# EAGLE design ARDEC-controller-v1 (EAGLE 9.1.2)
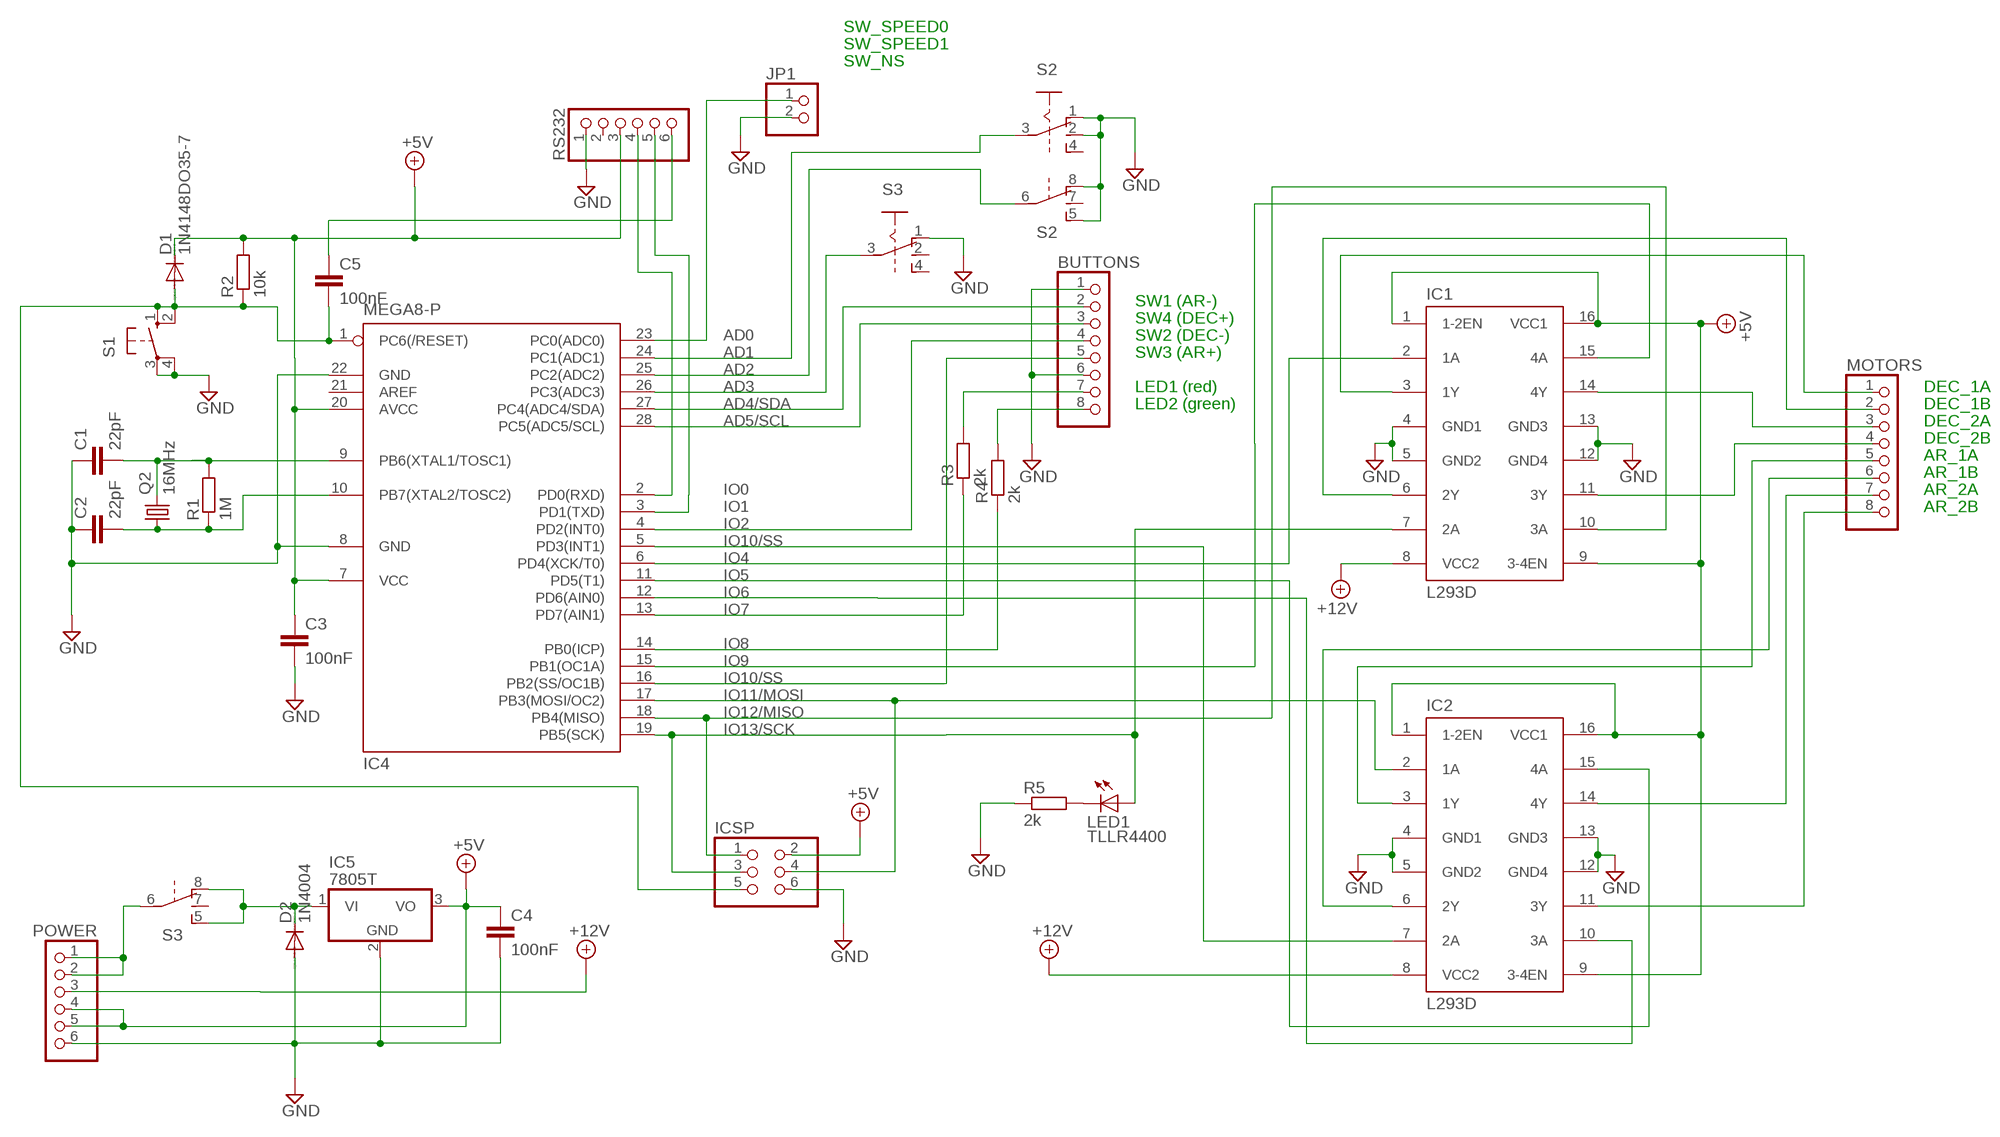
[diagram p0: schematic, sheet 1]

## Parts
BUTTONS  PINHD-1X8  [1X08]
C1  22pF  C2.5/2  [C2.5-2]
C2  22pF  C2.5/2  [C2.5-2]
C3  100nF  C-EU025_050-025X075  [C025_050-025X075]
C4  100nF  C-EU025_050-025X075  [C025_050-025X075]
C5  100nF  C-EU025_050-025X075  [C025_050-025X075]
D1  1N4148DO35-7  [DO35-7]
D2  1N4004  [DO41-10]
IC1  L293D  [DIL16]
IC2  L293D  [DIL16]
IC4  MEGA8-P  [DIL28-3]
IC5  7805T  [TO220H]
ICSP  PINHD-2X3  [2X03]
JP1  PINHD-1X2  [1X02]
LED1  TLLR4400  [LED3MM]
MOTORS  PINHD-1X8  [1X08]
POWER  PINHD-1X6  [1X06]
Q2  16MHz  CRYSTALHC18U-H  [HC18U-H]
R1  1M  R-EU_0207/10  [0207/10]
R2  10k  R-EU_0207/10  [0207/10]
R3  2k  R-EU_0207/10  [0207/10]
R4  2k  R-EU_0207/10  [0207/10]
R5  2k  R-EU_0207/10  [0207/10]
RS232  PINHD-1X6  [1X06]
S1  10-XX  [B3F-10XX]
S2  SL2C3P  [SL2C3P]
S3  SL2C3P  [SL2C3P]

## Nets
+5V [Power]: C3.1 C4.1 D1.C IC1.1(1-2EN) IC1.9(3-4EN) IC1.16(VCC1) IC2.1(1-2EN) IC2.9(3-4EN) IC2.16(VCC1) IC4.7(VCC) IC4.20(AVCC) IC5.3(VO) ICSP.2 POWER.4 POWER.5 R2.2 RS232.3
+12V [Power]: IC1.8(VCC2) IC2.8(VCC2) POWER.3
AD0: IC4.23(PC0(ADC0)) JP1.1
AD1: IC4.24(PC1(ADC1)) S2.3(A:Q)
AD2: IC4.25(PC2(ADC2)) S2.6(B:Q)
AD3: IC4.26(PC3(ADC3)) S3.3(A:Q)
AD4/SDA: BUTTONS.2 IC4.27(PC4(ADC4/SDA))
AD5/SCL: BUTTONS.3 IC4.28(PC5(ADC5/SCL))
GND [Power]: BUTTONS.1 BUTTONS.6 C1.1 C2.1 C3.2 C4.2 D2.A IC1.4(GND1) IC1.5(GND2) IC1.12(GND4) IC1.13(GND3) IC2.4(GND1) IC2.5(GND2) IC2.12(GND4) IC2.13(GND3) IC4.8(GND) IC4.22(GND) IC5.2(GND) ICSP.6 JP1.2 POWER.6 R5.1 RS232.1 S1.3(P) S1.4(P1) S2.1(A:O) S2.2(A:P) S2.5(B:R) S2.8(B:O) S3.1(A:O)
IO0: IC4.2(PD0(RXD)) RS232.4
IO1: IC4.3(PD1(TXD)) RS232.5
IO2: BUTTONS.4 IC4.4(PD2(INT0))
IO4: IC1.2(1A) IC4.6(PD4(XCK/T0))
IO5: IC2.15(4A) IC4.11(PD5(T1))
IO6: IC2.10(3A) IC4.12(PD6(AIN0))
IO7: IC4.13(PD7(AIN1)) R3.1
IO8: IC4.14(PB0(ICP)) R4.1
IO9: IC1.15(4A) IC4.15(PB1(OC1A))
IO10/SS: BUTTONS.5 IC4.16(PB2(SS/OC1B))
IO11/MOSI: IC2.2(1A) IC4.17(PB3(MOSI/OC2)) ICSP.4
IO12/MISO: IC1.10(3A) IC4.18(PB4(MISO)) ICSP.1
IO13/SCK: IC1.7(2A) IC4.19(PB5(SCK)) ICSP.3 LED1.A
N$1 [motors]: IC1.3(1Y) MOTORS.1
N$2 [motors]: IC1.6(2Y) MOTORS.2
N$3 [motors]: IC1.14(4Y) MOTORS.3
N$4 [motors]: IC1.11(3Y) MOTORS.4
N$5 [motors]: IC2.3(1Y) MOTORS.5
N$6 [motors]: IC2.6(2Y) MOTORS.6
N$7 [motors]: IC2.14(4Y) MOTORS.7
N$8 [motors]: IC2.11(3Y) MOTORS.8
N$9: BUTTONS.8 R4.2
N$10: BUTTONS.7 R3.2
N$11 [Power]: POWER.1 POWER.2 S3.6(B:Q)
N$12: LED1.K(C) R5.2
N$13: C1.2 IC4.9(PB6(XTAL1/TOSC1)) Q2.2 R1.2
N$14: C2.2 IC4.10(PB7(XTAL2/TOSC2)) Q2.1 R1.1
N$15: IC2.7(2A) IC4.5(PD3(INT1))
N$16: C5.1 RS232.6
N$17 [Power]: D2.C IC5.1(VI) S3.5(B:R) S3.8(B:O)
RESET: C5.2 D1.A IC4.1(PC6(/RESET)) ICSP.5 R2.1 S1.1(S) S1.2(S1)
Unconnected: IC4.21(AREF) RS232.2 S2.4(A:R) S2.7(B:P) S3.2(A:P) S3.4(A:R) S3.7(B:P)

## Notes on the sheet
- SW_SPEED0
- SW_SPEED1
- SW_NS
- SW1 (AR-)
- SW4 (DEC+)
- SW2 (DEC-)
- SW3 (AR+)
- LED1 (red) | DEC_1A
- LED2 (green) | DEC_1B
- DEC_2A
- DEC_2B
- AR_1A
- AR_1B
- AR_2A
- AR_2B

## Library data of the parts
BUTTONS MOTORS = pinhead:PINHD-1X8: PIN HEADER
C1 C2 = capacitor-wima:C: CAPACITOR naming: grid - package width
C3-C5 = resistor:C-EU: CAPACITOR, European symbol
D1 = diode:1N4148: DIODE high speed (Philips)
D2 = diode:1N4004: DIODE general purpose rectifier, 1 A
IC1 IC2 = st-microelectronics:L293D: PUSH-PULL 4 CHANNEL DRIVER; MPN: L293D; OC_FARNELL: 9589619; OC_NEWARK: 56P8249
IC4 = atmel:MEGA8-P: MICROCONTROLLER 8 Kbytes FLASH, 1 kbytes SRAM, 512 bytes EEPROM, USART, 4-channel 10 bit ADC, 2-channel 8 bit ADC Pin compatible with Atmega48, ATMega88, ATMega168 Source: avr.lbr; OC_FARNELL: unknown; OC_NEWARK: unknown
IC5 = linear:78*: Positive VOLTAGE REGULATOR Source: http://cache.national.com/ds/LM/LM78L05.pdf http://www.fairchildsemi.com/ds/LM/LM7805.pdf
ICSP = pinhead:PINHD-2X3: PIN HEADER
JP1 = pinhead:PINHD-1X2: PIN HEADER
LED1 = led:TLLR4400: Low Current (2mA) LED 3 mm Tinted Diffused Package color RED Source: Data sheet <http://www.farnell.com/datasheets/391100.pdf>; MF: VISHAY SEMICONDUCTOR; OC_FARNELL: 1612437
POWER RS232 = pinhead:PINHD-1X6: PIN HEADER
Q2 = crystal:CRYSTAL: CRYSTAL; OC_FARNELL: unknown; OC_NEWARK: unknown
R1-R5 = resistor:R-EU_: RESISTOR, European symbol
S1 = switch-omron:10-XX: OMRON SWITCH; MPN: B3F-1000; OC_FARNELL: 176432; OC_NEWARK: 36M3542
S2 S3 = sliding-switch:SL2C3P: SLIDING SWITCH 2C 3P

## Net classes
0 default: clearance 0.205 mm
1 Power: width 0.813 mm, clearance 0.205 mm to class 0, clearance 0.406 mm
2 motors: width 0.406 mm

## Board
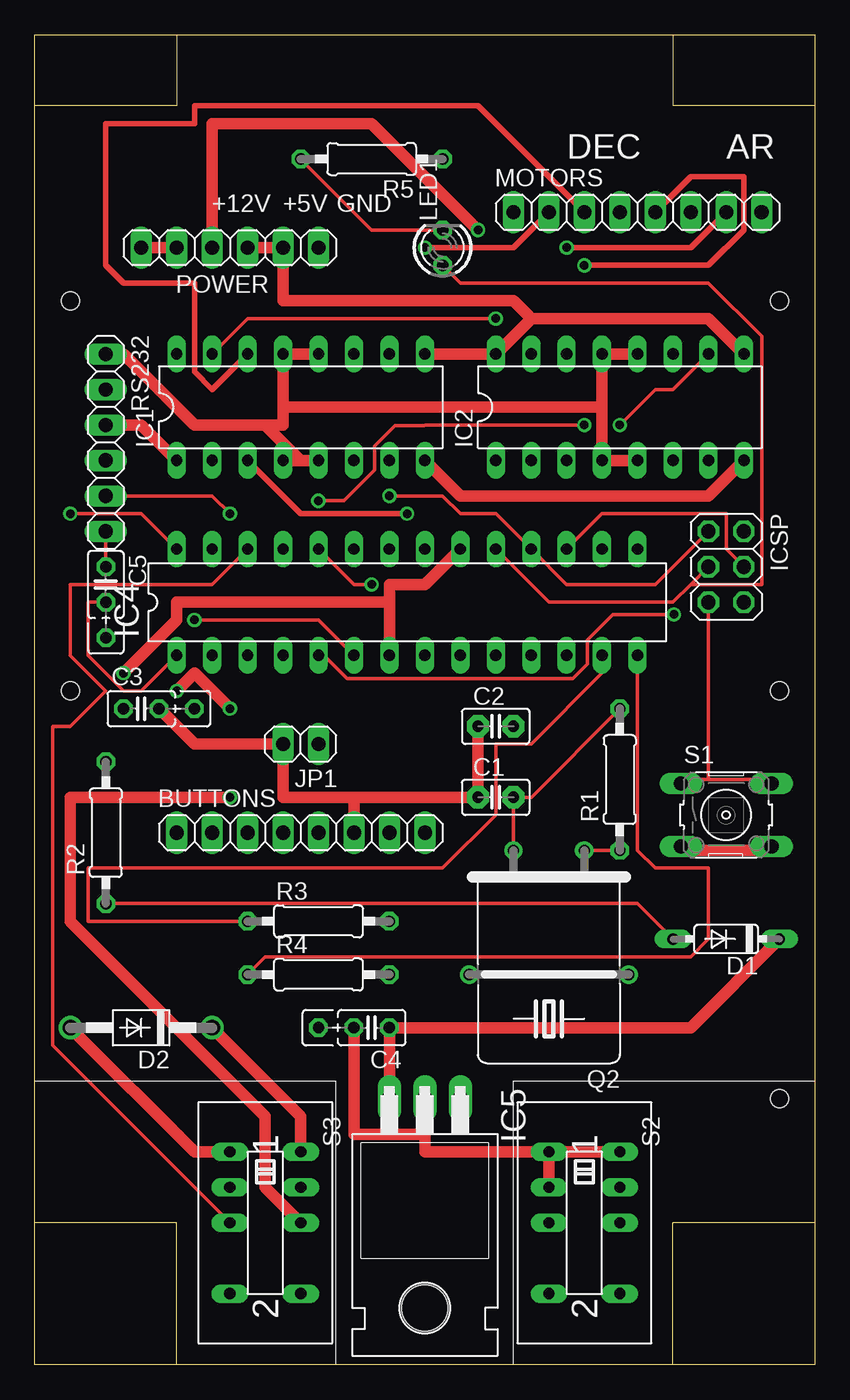
[diagram p1: board, top side]
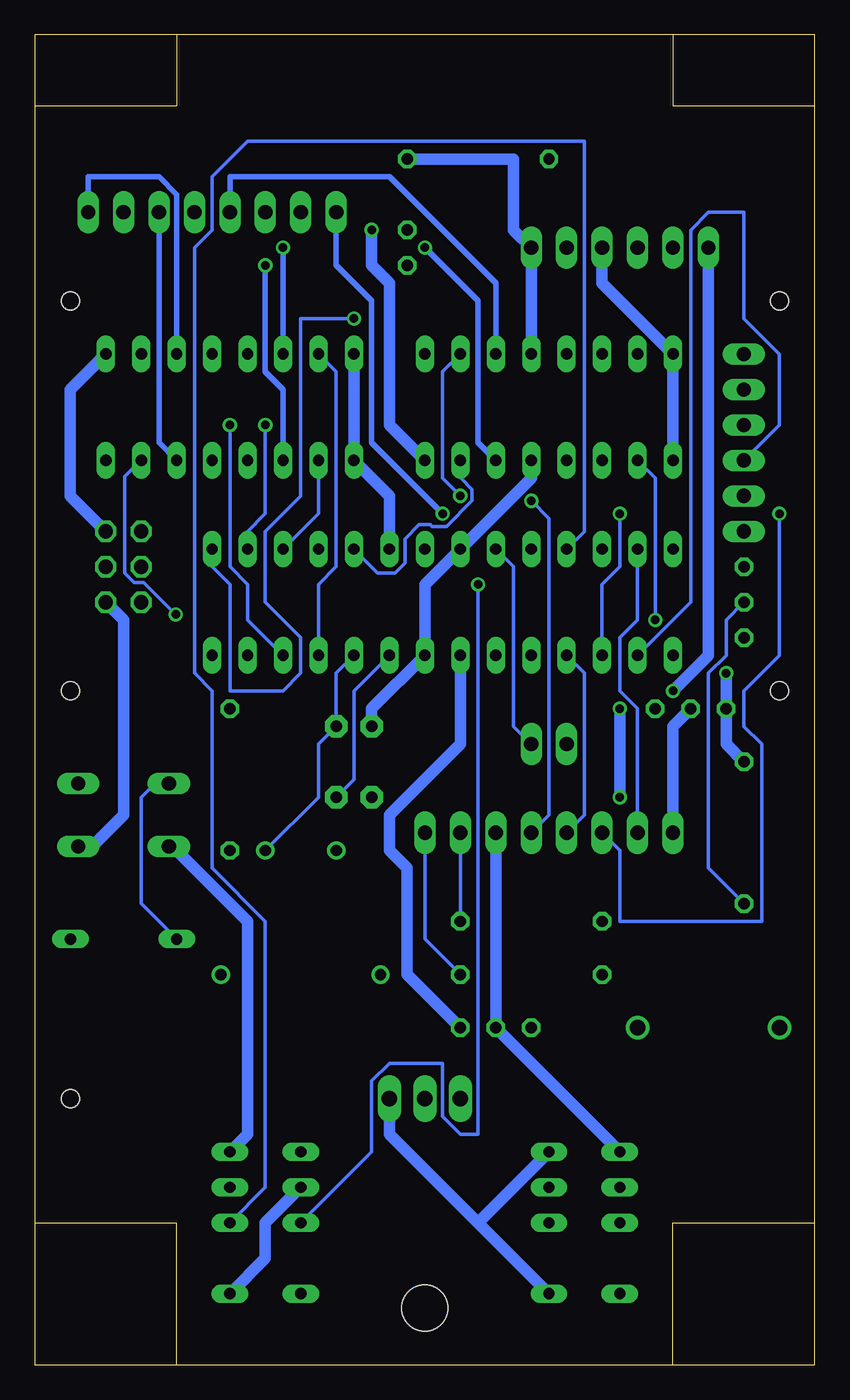
[diagram p2: board, bottom side, seen from below]

Size 55.88 x 95.25 mm. Coordinates in mm from the lower left corner, seen from the top.
Outline: 10.16,95.25 0,95.25 0,90.17
Outline: 10.16,95.25 45.72,95.25
Outline: 45.72,95.25 55.88,95.25 55.88,90.17
Outline: 45.72,0 55.88,0 55.88,7.62 55.88,10.16
Outline: 45.72,0 34.29,0 21.59,0 10.16,0
Outline: 10.16,0 0,0 0,7.62 0,10.16
Outline: 0,10.16 0,20.32 0,90.17
Outline: 55.88,90.17 55.88,20.32 55.88,10.16
Outline: 10.16,0 10.16,10.16 0,10.16
Outline: 55.88,10.16 45.72,10.16 45.72,0
Outline: 0,90.17 10.16,90.17 10.16,95.25
Outline: 55.88,90.17 45.72,90.17 45.72,95.25
Copper layers (1*16): Top 0.035mm / dielectric 1.5mm / Bottom 0.035mm
Design rules "default": minimum track width 10mil, minimum drill 24mil, track to track 8mil, track to pad 8mil, pad to pad 8mil, via to via 8mil, smd to smd 8mil, copper to edge 40mil, drill to drill 8mil, minimum pad ring 10mil, minimum via ring 8mil, stop-mask expansion 4mil, vias tented up to drill 0mil, thermal gap 10mil
Holes 1.3 mm at 53.34,19.05 2.54,76.2 53.34,76.2 2.54,48.26 53.34,48.26

### Footprints (pad centres in the part's own frame; a part is rotated, then mirrored left to right if it is on the bottom)
1X08 = drill 1.016 long: 1 -8.89,0; 2 -6.35,0; 3 -3.81,0; 4 -1.27,0; 5 1.27,0; 6 3.81,0; 7 6.35,0; 8 8.89,0
C2.5-2 = drill 0.813 pad 1.6 octagon: 1 -1.27,0; 2 1.27,0
C025_050-025X075 = drill 0.813 octagon: 1 -1.27,0; 2 1.27,0; 3 3.81,0
DO35-7 = drill 0.813 long: A 3.81,0; C -3.81,0
DO41-10 = drill 1.118: A 5.08,0; C -5.08,0
DIL16 = drill 0.813 long: 1 -8.89,-3.81; 2 -6.35,-3.81; 3 -3.81,-3.81; 4 -1.27,-3.81; 5 1.27,-3.81; 6 3.81,-3.81; 7 6.35,-3.81; 8 8.89,-3.81; 9 8.89,3.81; 10 6.35,3.81; 11 3.81,3.81; 12 1.27,3.81; 13 -1.27,3.81; 14 -3.81,3.81; 15 -6.35,3.81; 16 -8.89,3.81
DIL28-3 = drill 0.813 long: 1 -16.51,-3.81; 2 -13.97,-3.81; 3 -11.43,-3.81; 4 -8.89,-3.81; 5 -6.35,-3.81; 6 -3.81,-3.81; 7 -1.27,-3.81; 8 1.27,-3.81; 9 3.81,-3.81; 10 6.35,-3.81; 11 8.89,-3.81; 12 11.43,-3.81; 13 13.97,-3.81; 14 16.51,-3.81; 15 16.51,3.81; 16 13.97,3.81; 17 11.43,3.81; 18 8.89,3.81; 19 6.35,3.81; 20 3.81,3.81; 21 1.27,3.81; 22 -1.27,3.81; 23 -3.81,3.81; 24 -6.35,3.81; 25 -8.89,3.81; 26 -11.43,3.81; 27 -13.97,3.81; 28 -16.51,3.81
TO220H = drill 1.118 long: 1 -2.54,-10.16; 2 0,-10.16; 3 2.54,-10.16 | hole 3.302: 0,4.826
2X03 = drill 1.016 octagon: 1 -2.54,-1.27; 2 -2.54,1.27; 3 0,-1.27; 4 0,1.27; 5 2.54,-1.27; 6 2.54,1.27
1X02 = drill 1.016 long: 1 -1.27,0; 2 1.27,0
LED3MM = drill 0.813 octagon: A -1.27,0; K 1.27,0
1X06 = drill 1.016 long: 1 -6.35,0; 2 -3.81,0; 3 -1.27,0; 4 1.27,0; 5 3.81,0; 6 6.35,0
HC18U-H = drill 0.813: 1 -2.54,-5.08; 2 2.54,-5.08; M -5.715,3.81; M1 5.715,3.81
0207/10 = drill 0.813 octagon: 1 -5.08,0; 2 5.08,0
B3F-10XX = drill 1.016 long: 1 -3.251,2.261; 2 3.251,2.261; 3 -3.251,-2.261; 4 3.251,-2.261
SL2C3P = drill 0.813 long: 1 -2.54,-2.54; 2 0,-2.54; 3 2.54,-2.54; 4 7.62,-2.54; 5 7.62,2.54; 6 2.54,2.54; 7 0,2.54; 8 -2.54,2.54

### Placement (x,y rotation side)
BUTTONS  19.05,38.1 0 top
C1  33.02,40.64 0 top
C2  33.02,45.72 0 top
C3  7.62,46.99 0 top
C4  24.13,24.13 180 top
C5  5.08,55.88 270 top
D1  49.53,30.48 180 top
D2  7.62,24.13 180 top
IC1  19.05,68.58 0 top
IC2  41.91,68.58 0 top
IC4  26.67,54.61 0 top
IC5  27.94,8.89 180 top
ICSP  49.53,57.15 270 top
JP1  19.05,44.45 180 top
LED1  29.21,80.01 90 top
MOTORS  43.18,82.55 0 top
POWER  13.97,80.01 0 top
Q2  36.83,31.75 180 top
R1  41.91,41.91 90 top
R2  5.08,38.1 90 top
R3  20.32,31.75 0 top
R4  20.32,27.94 0 top
R5  24.13,86.36 180 top
RS232  5.08,66.04 270 top
S1  49.53,39.37 0 top
S2  39.37,12.7 270 top
S3  16.51,12.7 270 top

### Tracks (layer width: path | path; a pad name or v marks a point on that pad's centre or on a via)
+5V  (via drill 0.61)
  Top 0.813: IC5.3 C4.1 46.99,24.13 D1.C | POWER.4 POWER.5 17.78,76.2 34.29,76.2 35.56,74.93 | IC1.1 7.62,67.31 RS232.3 | IC1.9 IC2.16 35.56,74.93 | 25.4,54.61 25.4,55.88 27.94,55.88 IC4.20 | 25.4,54.61 IC4.7 | v6.35,49.53 10.16,53.34 10.16,54.61 25.4,54.61 | IC2.9 48.26,74.93 35.56,74.93
  Bottom 0.813: IC1.1 IC1.16 15.24,77.47 POWER.4 | IC2.9 53.34,69.85 53.34,62.23 ICSP.2 | R2.2 6.35,44.45 C3.1 v6.35,49.53 | IC4.20 30.48,62.23 IC2.1 IC2.16 | C4.1 29.21,27.94 29.21,35.56 30.48,36.83 30.48,39.37 25.4,44.45 IC4.7
+12V  (via drill 0.61)
  Top 0.813: IC1.8 30.48,62.23 48.26,62.23 IC2.8 | POWER.3 12.7,88.9 24.13,88.9 v31.75,81.28
  Bottom 0.813: v31.75,81.28 31.75,78.74 30.48,77.47 30.48,67.31 IC1.8
AD0
  Bottom 0.254: IC4.23 21.59,57.15 21.59,45.72 JP1.1
AD1  (via drill 0.61)
  Top 0.254: v24.13,55.88 22.86,55.88 IC4.24
  Bottom 0.254: S2.3 31.75,15.24 31.75,20.32 30.48,21.59 26.67,21.59 26.67,17.78 25.4,16.51 24.13,16.51 v24.13,55.88
AD2
  Bottom 0.254: S2.6 39.37,12.7 39.37,31.75 43.18,35.56 43.18,48.26 44.45,49.53 44.45,80.01 43.18,81.28 43.18,85.09 40.64,87.63 16.51,87.63 16.51,59.69 IC4.25
AD3
  Top 0.254: S3.3 1.27,22.86 1.27,45.72 2.54,45.72 5.08,48.26 2.54,50.8 2.54,55.88 12.7,55.88 IC4.26
AD4/SDA
  Bottom 0.254: IC4.27 12.7,53.34 13.97,52.07 13.97,48.26 12.7,46.99 BUTTONS.2
AD5/SCL  (via drill 0.61)
  Top 0.254: IC4.28 7.62,60.96 v2.54,60.96
  Bottom 0.254: v2.54,60.96 2.54,50.8 5.08,48.26 5.08,45.72 3.81,44.45 3.81,31.75 13.97,31.75 13.97,36.83 BUTTONS.3
GND
  Top 0.813: IC2.5 IC2.4 40.64,68.58 | IC2.12 IC2.13 40.64,68.58 | IC1.12 IC1.13 17.78,68.58 | IC1.5 19.05,64.77 | 19.05,64.77 IC1.4 | RS232.1 6.35,72.39 11.43,67.31 16.51,67.31 | 19.05,64.77 16.51,67.31 | 17.78,68.58 17.78,67.31 16.51,67.31 | 17.78,68.58 40.64,68.58 | 22.86,40.64 BUTTONS.6 | 22.86,40.64 C1.1 C2.1 | 22.86,40.64 17.78,40.64 JP1.2 11.43,44.45 C3.2 | D2.A 11.43,15.24 S3.1 | S1.3 46.99,36.83 52.07,36.83 S1.4 | S2.1 S2.2 | S2.1 S2.8 | 27.94,16.51 27.94,15.24 S2.1 | 27.94,16.51 IC5.2 | C4.2 22.86,16.51 27.94,16.51
  Bottom 0.813: R5.1 21.59,86.36 21.59,81.28 POWER.6 IC1.12 | IC1.5 20.32,63.5 IC4.22 27.94,55.88 IC4.8 31.75,46.99 C2.1 | C3.2 10.16,45.72 BUTTONS.1 | S3.1 C4.2 BUTTONS.6 | ICSP.6 49.53,53.34 49.53,39.37 52.07,36.83 S1.4 | S2.5 39.37,7.62 39.37,10.16 S2.2 | S2.8 40.64,16.51 40.64,31.75 45.72,36.83 S1.3
IO0
  Bottom 0.254: IC4.2 8.89,54.61 8.89,81.28 7.62,82.55 5.08,82.55 5.08,74.93 2.54,72.39 2.54,67.31 RS232.4
IO1  (via drill 0.61)
  Top 0.254: v13.97,60.96 12.7,62.23 RS232.5
  Bottom 0.254: IC4.3 15.24,55.88 13.97,57.15 v13.97,60.96
IO2
  Bottom 0.254: IC4.4 16.51,49.53 16.51,39.37 BUTTONS.4
IO4  (via drill 0.61)
  Top 0.254: IC4.6 20.32,53.34 v11.43,53.34
  Bottom 0.254: v11.43,53.34 11.43,63.5 IC1.2
IO5
  Bottom 0.254: IC4.11 35.56,55.88 34.29,57.15 34.29,71.12 IC2.15
IO6  (via drill 0.61)
  Top 0.254: v41.91,67.31 44.45,69.85 45.72,69.85 IC2.10
  Bottom 0.254: IC4.12 40.64,53.34 40.64,55.88 41.91,57.15 v41.91,67.31
IO7
  Top 0.254: R3.1 3.81,31.75 3.81,35.56 29.21,35.56 33.02,39.37 33.02,44.45 35.56,44.45 40.64,49.53 IC4.13
IO8
  Top 0.254: R4.1 16.51,29.21 46.99,29.21 48.26,30.48 48.26,35.56 44.45,35.56 43.18,36.83 IC4.14
IO9  (via drill 0.61)
  Top 0.254: IC1.15 15.24,74.93 v33.02,74.93
  Bottom 0.254: v33.02,74.93 36.83,74.93 36.83,62.23 39.37,59.69 39.37,54.61 36.83,52.07 36.83,49.53 38.1,48.26 41.91,48.26 41.91,55.88 43.18,57.15 IC4.15
IO10/SS  (via drill 0.61)
  Top 0.254: v39.37,67.31 27.94,67.31 27.88,67.27 25.82,67.27 24.33,65.78 24.33,64.06 22.15,61.88 v20.31,61.88
  Bottom 0.254: BUTTONS.5 19.05,39.37 19.05,49.53 19.05,49.6 19.05,60.62 v20.31,61.88 | v39.37,67.31 39.37,60.96 40.64,59.69 IC4.16
IO11/MOSI
  Top 0.254: ICSP.4 49.53,58.42 49.53,60.96 40.64,60.96 IC4.17
  Bottom 0.254: IC4.17 35.56,60.96 IC2.2
IO12/MISO  (via drill 0.61)
  Top 0.254: ICSP.1 44.45,55.88 38.1,55.88 IC4.18 33.02,60.96 30.48,60.96 29.21,62.23 v25.4,62.23
  Bottom 0.254: IC1.10 26.67,71.12 26.67,63.5 v25.4,62.23
IO13/SCK
  Top 0.254: IC4.19 36.83,54.61 45.72,54.61 46.99,55.88 | ICSP.3 46.99,55.88 | LED1.A 30.48,77.47 48.26,77.47 52.07,73.66 52.07,55.88 46.99,55.88
  Bottom 0.254: IC1.7 25.36,64.75 25.36,63.49 24.56,62.68 24.56,61.88 26.39,60.05 27.43,60.05 27.54,60.16 28.34,60.16 29.38,59.13 29.38,57.41 30.06,56.72 31.33,56.72 32.93,58.32 IC4.19
N$1  (via drill 0.61)
  Top 0.406: IC1.3 19.05,60.96 v26.67,60.96
  Bottom 0.406: v26.67,60.96 31.75,66.04 31.75,76.2 34.29,78.74 MOTORS.1
N$2  (via drill 0.61)
  Top 0.406: v27.94,80.01 34.29,80.01 MOTORS.2
  Bottom 0.406: IC1.6 24.13,66.04 24.13,76.2 v27.94,80.01
N$3
  Top 0.406: IC1.14 12.7,69.85 11.43,71.12 11.43,77.47 6.35,77.47 5.08,78.74 5.08,88.9 11.43,88.9 11.43,90.17 31.75,90.17 MOTORS.3
N$4
  Bottom 0.406: IC1.11 22.86,77.47 30.48,85.09 41.91,85.09 MOTORS.4
N$5  (via drill 0.61)
  Top 0.406: v39.37,78.74 48.26,78.74 50.8,81.28 50.8,85.09 46.99,85.09 MOTORS.5
  Bottom 0.406: IC2.3 38.1,69.85 39.37,71.12 v39.37,78.74
N$6
  Bottom 0.406: IC2.6 46.99,66.04 MOTORS.6
N$7  (via drill 0.61)
  Top 0.406: v38.1,80.01 46.99,80.01 MOTORS.7
  Bottom 0.406: v38.1,80.01 IC2.14
N$8
  Bottom 0.406: IC2.11 45.72,83.82 46.99,85.09 52.07,85.09 MOTORS.8
N$9
  Bottom 0.254: R4.2 27.94,30.48 BUTTONS.8
N$10
  Bottom 0.254: BUTTONS.7 R3.2
N$11  (via drill 0.61)
  Top 0.813: S3.6 16.51,12.7 16.51,17.78 2.54,31.75 2.54,40.64 v13.97,40.64 | v13.97,46.99 11.43,49.53 v10.16,48.26 | POWER.1 POWER.2
  Bottom 0.813: v13.97,46.99 v13.97,40.64 | v10.16,48.26 7.62,50.8 POWER.1
N$12
  Top 0.254: R5.2 24.13,81.28 LED1.K
N$13
  Top 0.254: Q2.2 C1.2 35.56,40.64 R1.2
  Bottom 0.254: IC4.9 33.02,48.26 33.02,41.91 C1.2
N$14
  Top 0.254: R1.1 Q2.1
  Bottom 0.254: IC4.10 34.29,49.53 C2.2 35.56,44.45 35.56,40.64 Q2.1
N$15  (via drill 0.61)
  Top 0.254: v45.78,53.73 41.42,53.73 39.59,51.9 39.59,50.18 38.56,49.14 22.38,49.14 20.77,50.75 20.43,50.75 IC4.5
  Bottom 0.254: v45.78,53.73 48.08,56.03 48.77,56.03 49.46,56.72 49.46,63.6 48.31,64.75 IC2.7
N$16
  Top 0.254: RS232.6 C5.1
N$17
  Top 0.813: D2.C 19.05,17.78 S3.8
  Bottom 0.813: 24.13,10.16 30.48,16.51 IC5.1 | 24.13,10.16 S3.5 | 24.13,10.16 S3.8
RESET
  Top 0.254: IC4.1 7.62,48.26 6.35,48.26 3.81,50.8 3.81,54.61 C5.2 | 48.26,41.91 46.99,41.91 S1.1 | 48.26,41.91 52.07,41.91 S1.2 | 48.26,41.91 ICSP.5 | R2.1 43.18,33.02 D1.A
  Bottom 0.254: R2.1 7.62,35.56 7.62,49.53 6.35,50.8 6.35,53.34 C5.2 | D1.A 48.26,33.02 48.26,40.64 46.99,41.91 S1.1

### Text on the board
tNames: DEC | AR | +12V | +5V | GND